# EAGLE schematic SCHEMATIC (EAGLE 9.6.2)

## Sheet 1 of 2
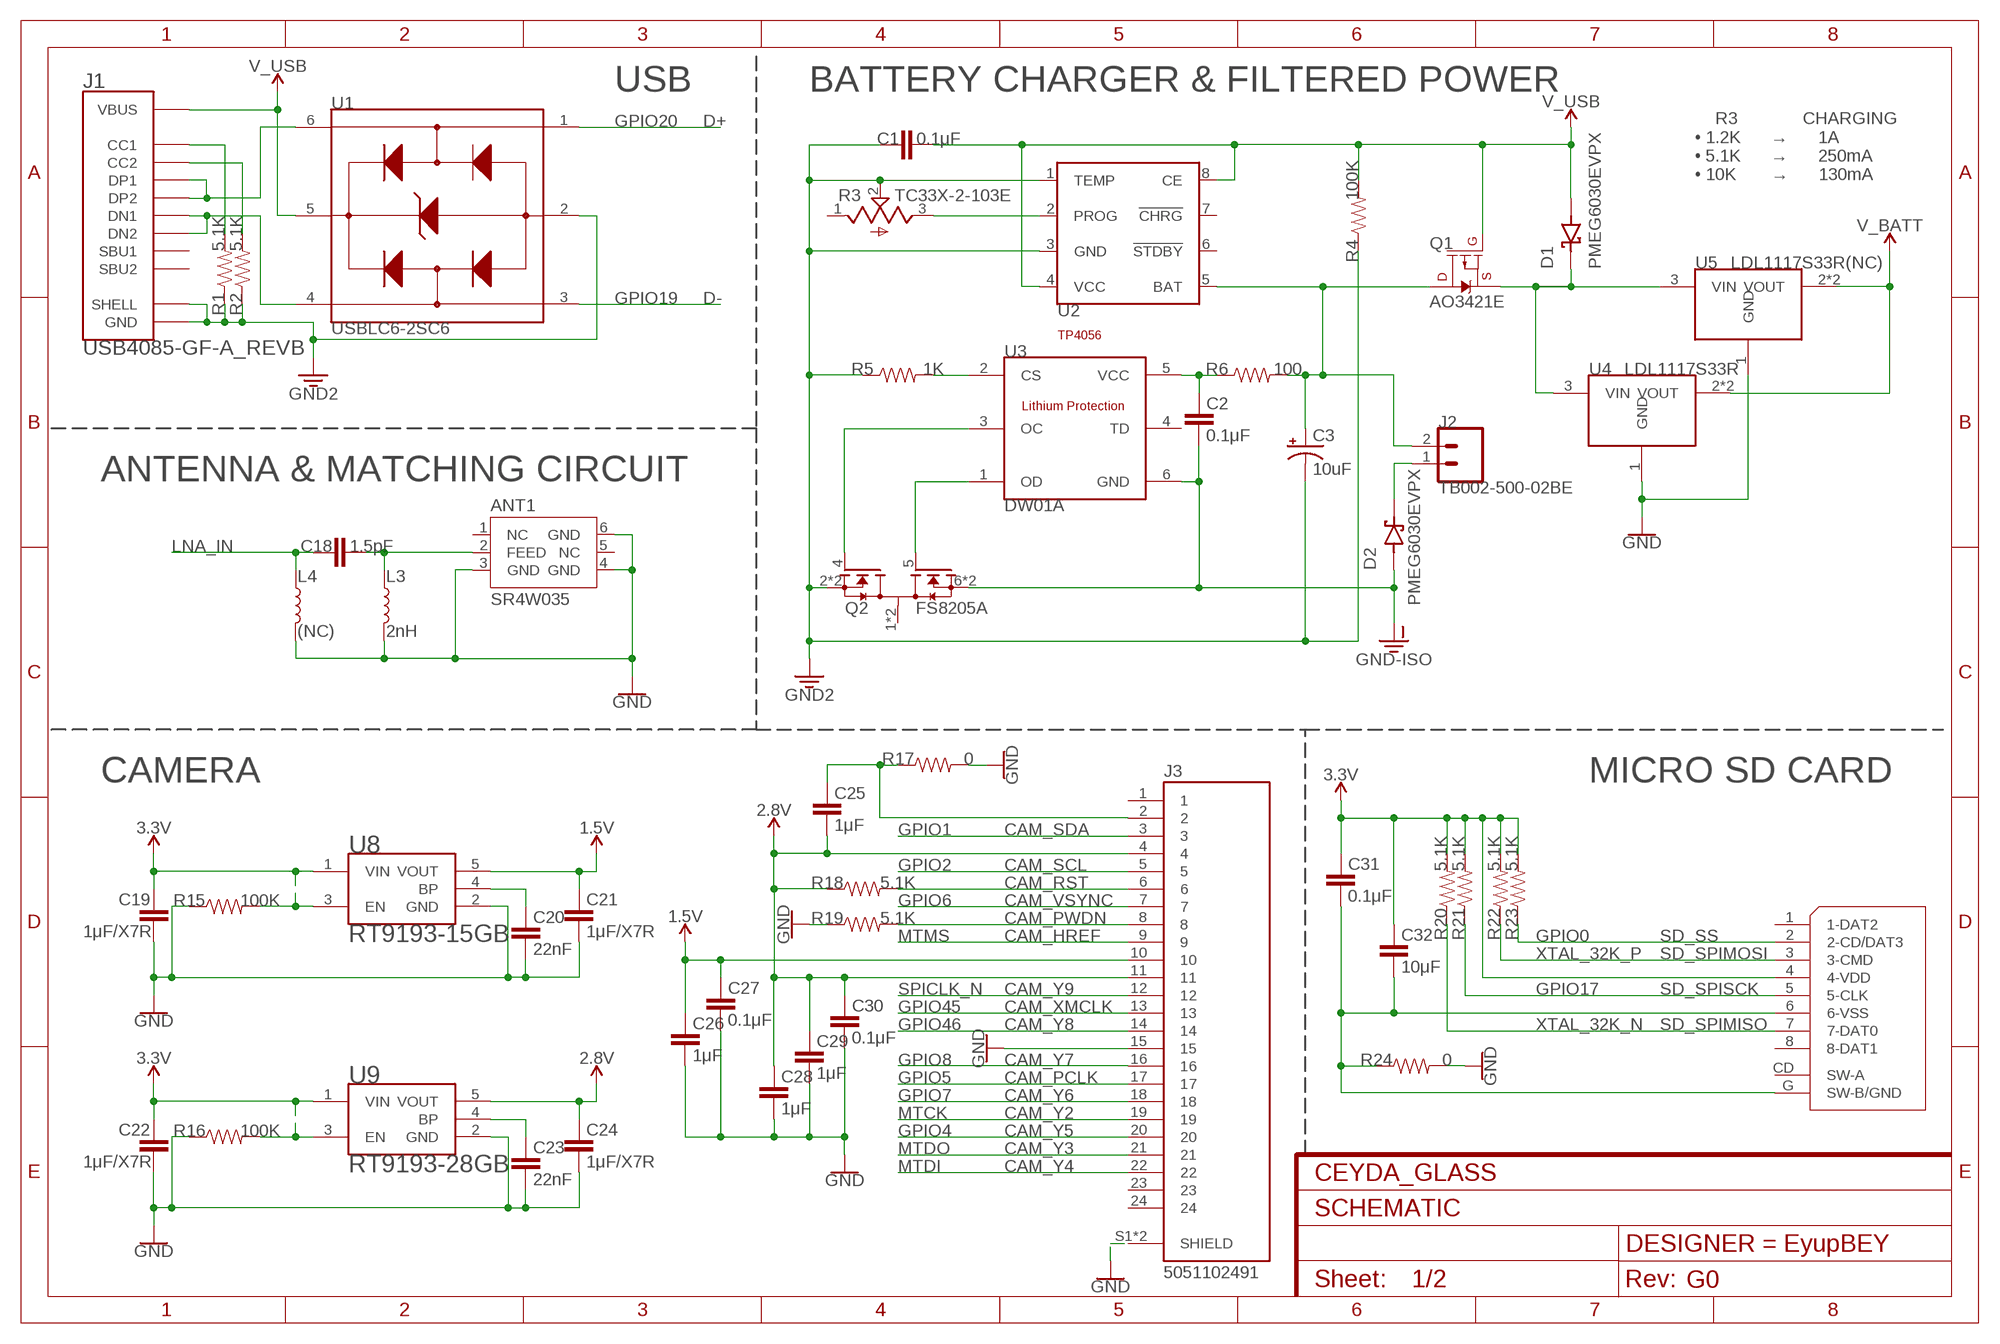
[diagram p0: schematic, sheet 1]
FRAME1 (FRAME-A4L): CNAME: CEYDA_GLASS; CREVISION: G0; DESIGNER: EyupBEY

### Parts
ANT1  SR4W035  [SR4W035]
C1  0.1μF  1.0UF-0805-25V-10%  [0805]
C2  0.1μF  1.0UF-0805-25V-10%  [0805]
C3  10uF  10UF-POLAR-RADIAL-2.5MM-25V-20%  [CPOL-RADIAL-2.5MM-5MM]
C18  1.5pF  15PF-0402-50V-5%  [0402]
C19  1μF/X7R  1.0UF-0805-25V-10%  [0805]
C20  22nF  10NF-0603-50V-10%  [0603]
C21  1μF/X7R  1.0UF-0805-25V-10%  [0805]
C22  1μF/X7R  1.0UF-0805-25V-10%  [0805]
C23  22nF  10NF-0603-50V-10%  [0603]
C24  1μF/X7R  1.0UF-0805-25V-10%  [0805]
C25  1μF  1.0UF-0805-25V-10%  [0805]
C26  1μF  1.0UF-0805-25V-10%  [0805]
C27  0.1μF  1.0UF-0805-25V-10%  [0805]
C28  1μF  1.0UF-0805-25V-10%  [0805]
C29  1μF  1.0UF-0805-25V-10%  [0805]
C30  0.1μF  1.0UF-0805-25V-10%  [0805]
C31  0.1μF  1.0UF-0805-25V-10%  [0805]
C32  10μF  1.0UF-0805-25V-10%  [0805]
D1  PMEG6030EVPX  [DIO_PMEG6030EVPX]
D2  PMEG6030EVPX  [DIO_PMEG6030EVPX]
J1  USB4085-GF-A_REVB  [GCT_USB4085-GF-A_REVB]
J2  TB002-500-02BE  CONN_025MM  [SCREWTERMINAL-5MM-2]
J3  5051102491  [MOLEX_5051102491]
K1  112J-TDAR-R01  [112J-TDAR-R01]
L3  2nH  INDUCTOR-0402-3.9NH  [0402]
L4  (NC)  INDUCTOR-0402-3.9NH  [0402]
Q1  AO3421E  MOSFET_PCH-DMG2307L  [SOT23-3]
Q2  FS8205A  [SOP65P640X120-8N]
R1  5.1K  5.1KOHM5.1KOHM-0603-1/10W-1%  [0603]
R2  5.1K  5.1KOHM5.1KOHM-0603-1/10W-1%  [0603]
R3  TC33X-2-103E  [TRIM_TC33X-2-103E]
R4  100K  0OHM-0603-1/10W  [0603]
R5  1K  1KOHM-0603-1/10W-1%  [0603]
R6  100  100OHM-0603-1/10W-1%  [0603]
R15  100K  0OHM-0603-1/10W  [0603]
R16  100K  0OHM-0603-1/10W  [0603]
R17  0  0OHM-0603-1/10W  [0603]
R18  5.1K  5.1KOHM5.1KOHM-0603-1/10W-1%  [0603]
R19  5.1K  5.1KOHM5.1KOHM-0603-1/10W-1%  [0603]
R20  5.1K  5.1KOHM5.1KOHM-0603-1/10W-1%  [0603]
R21  5.1K  5.1KOHM5.1KOHM-0603-1/10W-1%  [0603]
R22  5.1K  5.1KOHM5.1KOHM-0603-1/10W-1%  [0603]
R23  5.1K  5.1KOHM5.1KOHM-0603-1/10W-1%  [0603]
R24  0  0OHM-0603-1/10W  [0603]
U1  USBLC6-2SC6  [SOT95P280X145-6N]
U2  TP4056  [SOT23-8]
U3  DW01A  [SOT23-6]
U4  LDL1117S33R  [SOT230P700X180-4N]
U5  LDL1117S33R(NC)  LDL1117S33R  [SOT230P700X180-4N]
U8  RT9193-15GB  RT9193-33GB  [SOT94P279X129-5N]
U9  RT9193-28GB  RT9193-33GB  [SOT94P279X129-5N]

### Nets
1.8V: C21.2 C26.2 C27.2 J3.10 U8.5(VOUT) ; supply symbol labelled 1.5V
2.8V: C24.2 C25.1 C28.2 C29.2 C30.2 J3.4 J3.11 R18.1 U9.5(VOUT)
3.3V: C1.1 C3.2(-) C19.2 C22.2 C31.2 C32.2 J1.A1(GND) J1.A12(GND) J1.B1(GND) J1.B12(GND) J1.S1(SHELL) J1.S2(SHELL) J1.S3(SHELL) J1.S4(SHELL) K1.4(4-VDD) Q2.2(S1) Q2.3(S1) R1.1 R2.1 R3.2(W) R4.1 R5.1 R15.2 R16.2 R20.2 R21.2 R22.2 R23.2 U1.2(GND) U2.1(TEMP) U2.3(GND) U8.1(VIN) U8.3(EN) U9.1(VIN) U9.3(EN) ; supply symbol labelled GND2 ; also sheet 2
GND: ANT1.3(GND) ANT1.4(GND) ANT1.6(GND) C19.1 C20.1 C21.1 C22.1 C23.1 C24.1 C26.1 C27.1 C28.1 C29.1 C30.1 J3.15 J3.S1(SHIELD) J3.S2(SHIELD) L3.2 L4.2 R15.1 R16.1 R17.2 R19.1 R24.2 U4.1(GND) U5.1(GND) U8.2(GND) U9.2(GND) ; also sheet 2
GND-ISO: C2.1 D2.2(A) Q2.6(S2) Q2.7(S2) U3.6(GND) ; also sheet 2
GPIO0: K1.2(2-CD/DAT3) R23.1 ; also sheet 2
GPIO1: J3.3 ; also sheet 2
GPIO2: J3.5 ; also sheet 2
GPIO4: J3.20 ; also sheet 2
GPIO5: J3.17 ; also sheet 2
GPIO6: J3.7 ; also sheet 2
GPIO7: J3.18 ; also sheet 2
GPIO8: J3.16 ; also sheet 2
GPIO17: K1.5(5-CLK) R21.1 ; also sheet 2
GPIO19: U1.3(I/O2_IN) ; also sheet 2
GPIO20: U1.1(I/O1_IN) ; also sheet 2
GPIO45: J3.13 ; also sheet 2
GPIO46: J3.14 ; also sheet 2
LNA_IN: C18.1 L4.1 ; also sheet 2
MTCK: J3.19 ; also sheet 2
MTDI: J3.22 ; also sheet 2
MTDO: J3.21 ; also sheet 2
MTMS: J3.9 ; also sheet 2
N$1: J1.A7(DN1) J1.B7(DN2) U1.4(I/O2_OUT)
N$2: Q2.5(G2) U3.1(OD)
N$3: Q2.4(G1) U3.3(OC)
N$4: J1.A6(DP1) J1.B6(DP2) U1.6(I/O1_OUT)
N$5: R5.2 U3.2(CS)
N$6: J1.A5(CC1) R1.2
N$7: J1.B5(CC2) R2.2
N$8: R3.3(CW) U2.2(PROG)
N$10: D2.1(K) J2.1
N$11: C2.2 R6.1 U3.5(VCC)
N$12: ANT1.2(FEED) C18.2 L3.1
N$16: C20.2 U8.4(BP)
N$17: C23.2 U9.4(BP)
N$18: C25.2 J3.2 R17.1
N$19: J3.8 R19.2
N$20: C31.1 C32.1 K1.6(6-VSS) K1.G(SW-B/GND) R24.1
N$23: C3.1(+) J2.2 Q1.3(D) R6.2 U2.5(BAT)
N$27: J3.6 R18.2
N$28: D1.1(K) Q1.2(S) U4.3(VIN) U5.3(VIN)
SPICLK_N: J3.12 ; also sheet 2
V_BATT: U4.2(VOUT) U4.4(VOUT) U5.2(VOUT) U5.4(VOUT) ; also sheet 2
V_USB: C1.2 D1.2(A) J1.A4(VBUS) J1.A9(VBUS) J1.B4(VBUS) J1.B9(VBUS) Q1.1(G) R4.2 U1.5(VBUS) U2.4(VCC) U2.8(CE)
XTAL_32K_N: K1.7(7-DAT0) R20.1 ; also sheet 2
XTAL_32K_P: K1.3(3-CMD) R22.1 ; also sheet 2
Unconnected: ANT1.1(NC) ANT1.5(NC) J1.A8(SBU1) J1.B8(SBU2) J3.1 J3.23 J3.24 K1.1(1-DAT2) K1.8(8-DAT1) K1.CD(SW-A) Q2.1(D12) Q2.8(D12) R3.1(CCW) U2.6(!STDBY) U2.7(!CHRG) U3.4(TD)

### Notes on the sheet
- USB | BATTERY CHARGER & FILTERED POWER
- D+
- R3             CHARGING
  • 1.2K      →      1A
  • 5.1K      →      250mA
  • 10K       →      130mA
- D-
- ANTENNA & MATCHING CIRCUIT
- CAMERA | MICRO SD CARD
- CAM_SDA
- CAM_SCL
- CAM_RST
- CAM_VSYNC
- CAM_PWDN
- CAM_HREF | SD_SS
- SD_SPIMOSI
- CAM_Y9 | SD_SPISCK
- CAM_XMCLK
- CAM_Y8 | SD_SPIMISO
- CAM_Y7
- CAM_PCLK
- CAM_Y6
- CAM_Y2
- CAM_Y5
- CAM_Y3
- CAM_Y4

## Sheet 2 of 2
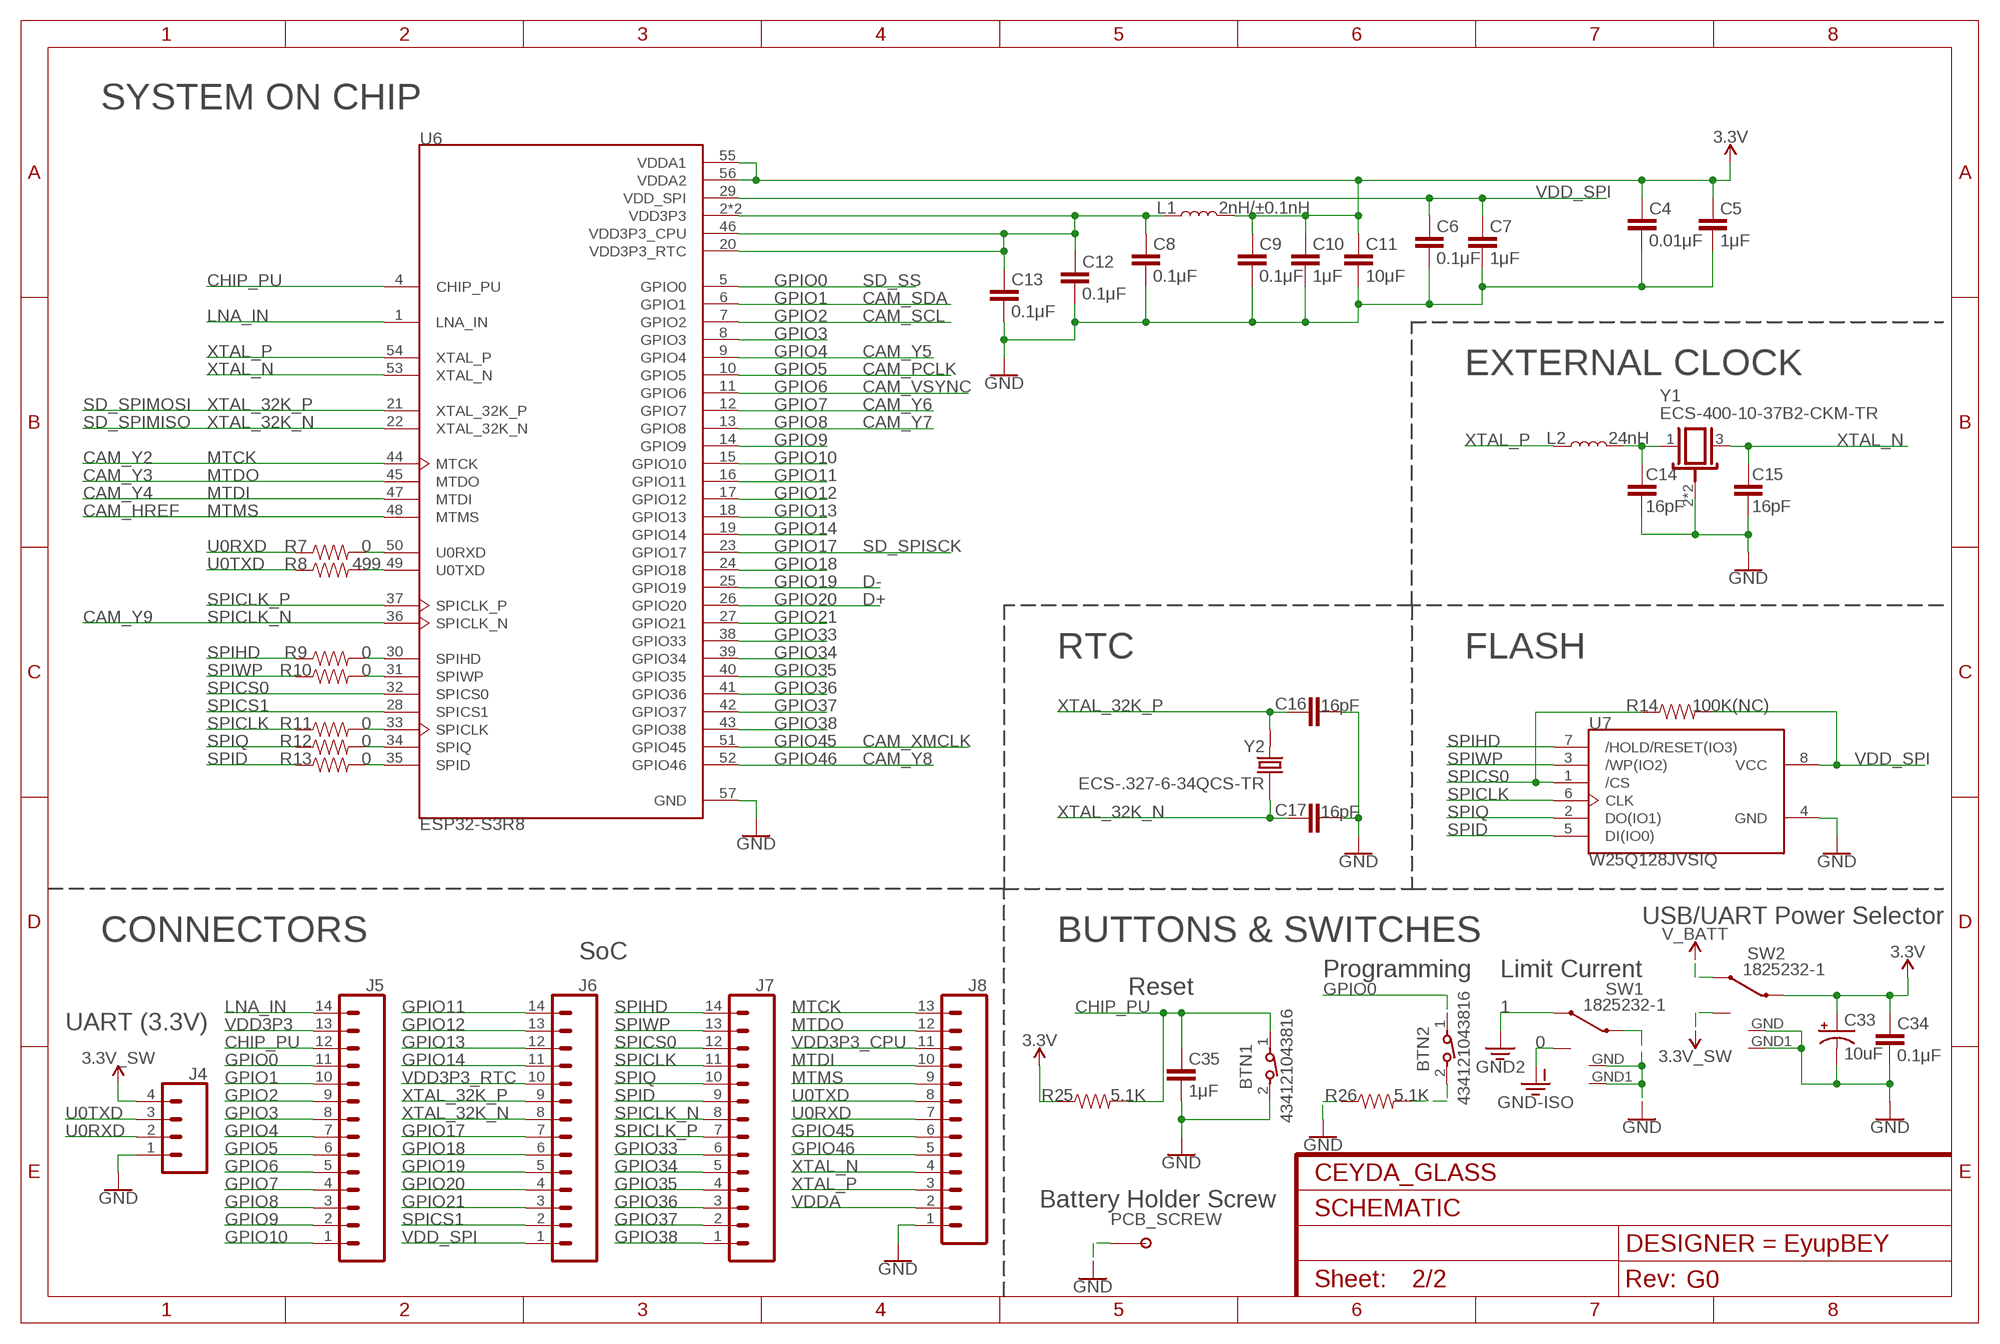
[diagram p1: schematic, sheet 2]
FRAME2 (FRAME-A4L): CNAME: CEYDA_GLASS; CREVISION: G0; DESIGNER: EyupBEY

### Parts
BTN1  434121043816  [434121043816]
BTN2  434121043816  [434121043816]
C4  0.01μF  10NF-0603-50V-10%  [0603]
C5  1μF  1.0UF-0805-25V-10%  [0805]
C6  0.1μF  1.0UF-0805-25V-10%  [0805]
C7  1μF  1.0UF-0805-25V-10%  [0805]
C8  0.1μF  1.0UF-0805-25V-10%  [0805]
C9  0.1μF  1.0UF-0805-25V-10%  [0805]
C10  1μF  1.0UF-0805-25V-10%  [0805]
C11  10μF  1.0UF-0805-25V-10%  [0805]
C12  0.1μF  1.0UF-0805-25V-10%  [0805]
C13  0.1μF  1.0UF-0805-25V-10%  [0805]
C14  16pF  0.1UF-0402-16V-10%  [0402]
C15  16pF  0.1UF-0402-16V-10%  [0402]
C16  16pF  0.1UF-0402-16V-10%  [0402]
C17  16pF  0.1UF-0402-16V-10%  [0402]
C33  10uF  10UF-POLAR-RADIAL-2.5MM-25V-20%  [CPOL-RADIAL-2.5MM-5MM]
C34  0.1μF  1.0UF-0805-25V-10%  [0805]
C35  1μF  1.0UF-0805-25V-10%  [0805]
J4  CONN_04PTH  [1X04]
J5  CONN_14  [1X14]
J6  CONN_14  [1X14]
J7  CONN_14  [1X14]
J8  CONN_13  [1X13]
L1  2nH/±0.1nH  INDUCTOR-0402-3.9NH  [0402]
L2  24nH  INDUCTOR-0603-15NH  [0603]
PCB_SCREW  PCB_SCREW_TERMINAL  [NINIGI_PCB_1M4]
R7  0  0OHM-0603-1/10W  [0603]
R8  499  0OHM-0603-1/10W  [0603]
R9  0  0OHM-0603-1/10W  [0603]
R10  0  0OHM-0603-1/10W  [0603]
R11  0  0OHM-0603-1/10W  [0603]
R12  0  0OHM-0603-1/10W  [0603]
R13  0  0OHM-0603-1/10W  [0603]
R14  100K(NC)  0OHM-0603-1/10W  [0603]
R25  5.1K  5.1KOHM5.1KOHM-0603-1/10W-1%  [0603]
R26  5.1K  5.1KOHM5.1KOHM-0603-1/10W-1%  [0603]
SW1  1825232-1  [1825232-1]
SW2  1825232-1  [1825232-1]
U6  ESP32-S3R8  ESP32-S3  [IC_ESP32-S3]
U7  W25Q128JVSIQ  [SOIC127P790X216-8N]
Y1  ECS-400-10-37B2-CKM-TR  [XTAL_ECS-400-10-37B2-CKM-TR]
Y2  ECS-.327-6-34QCS-TR  [XTAL_ECS-.327-6-34QCS-TR]

### Nets
3.3V: C4.2 C5.2 C9.2 C10.2 C11.2 C33.1(+) C34.2 L1.2 R25.1 SW1.3 SW2.2 U6.55(VDDA1) U6.56(VDDA2) ; supply symbol labelled GND2 ; also sheet 1
3.3V_SW: J4.4 SW2.1
CHIP_PU: BTN1.1 C35.2 J5.12 R25.2 U6.4(CHIP_PU)
GND: BTN1.2 C4.1 C5.1 C6.1 C7.1 C8.1 C9.1 C10.1 C11.1 C12.1 C13.1 C14.1 C15.1 C16.2 C17.2 C33.2(-) C34.1 C35.1 J4.1 J8.1 PCB_SCREW.1 PCB_SCREW.2 PCB_SCREW.3 PCB_SCREW.4 PCB_SCREW.C R26.1 SW1.2 SW1.GND SW1.GND1 SW2.GND SW2.GND1 U6.57(GND) U7.4(GND) Y1.2(GND) Y1.4(GND) ; also sheet 1
GND-ISO: SW1.1 ; also sheet 1
GPIO0: BTN2.1 J5.11 U6.5(GPIO0) ; also sheet 1
GPIO1: J5.10 U6.6(GPIO1) ; also sheet 1
GPIO2: J5.9 U6.7(GPIO2) ; also sheet 1
GPIO3: J5.8 U6.8(GPIO3)
GPIO4: J5.7 U6.9(GPIO4) ; also sheet 1
GPIO5: J5.6 U6.10(GPIO5) ; also sheet 1
GPIO6: J5.5 U6.11(GPIO6) ; also sheet 1
GPIO7: J5.4 U6.12(GPIO7) ; also sheet 1
GPIO8: J5.3 U6.13(GPIO8) ; also sheet 1
GPIO9: J5.2 U6.14(GPIO9)
GPIO10: J5.1 U6.15(GPIO10)
GPIO11: J6.14 U6.16(GPIO11)
GPIO12: J6.13 U6.17(GPIO12)
GPIO13: J6.12 U6.18(GPIO13)
GPIO14: J6.11 U6.19(GPIO14)
GPIO17: J6.7 U6.23(GPIO17) ; also sheet 1
GPIO18: J6.6 U6.24(GPIO18)
GPIO19: J6.5 U6.25(GPIO19) ; also sheet 1
GPIO20: J6.4 U6.26(GPIO20) ; also sheet 1
GPIO21: J6.3 U6.27(GPIO21)
GPIO33: J7.6 U6.38(GPIO33)
GPIO34: J7.5 U6.39(GPIO34)
GPIO35: J7.4 U6.40(GPIO35)
GPIO36: J7.3 U6.41(GPIO36)
GPIO37: J7.2 U6.42(GPIO37)
GPIO38: J7.1 U6.43(GPIO38)
GPIO45: J8.6 U6.51(GPIO45) ; also sheet 1
GPIO46: J8.5 U6.52(GPIO46) ; also sheet 1
LNA_IN: J5.14 U6.1(LNA_IN) ; also sheet 1
MTCK: J8.13 U6.44(MTCK) ; also sheet 1
MTDI: J8.10 U6.47(MTDI) ; also sheet 1
MTDO: J8.12 U6.45(MTDO) ; also sheet 1
MTMS: J8.9 U6.48(MTMS) ; also sheet 1
N$9: C8.2 C12.2 C13.2 L1.1 U6.2(VDD3P3) U6.3(VDD3P3) U6.20(VDD3P3_RTC) U6.46(VDD3P3_CPU)
N$13: C14.2 L2.2 Y1.1
N$21: R7.2 U6.50(U0RXD)
N$22: R8.2 U6.49(U0TXD)
N$25: R9.2 U6.30(SPIHD)
N$26: R10.2 U6.31(SPIWP)
N$29: R11.2 U6.33(SPICLK)
N$30: R12.2 U6.34(SPIQ)
N$31: R13.2 U6.35(SPID)
N$32: BTN2.2 R26.2
SPICLK: J7.11 R11.1 U7.6(CLK)
SPICLK_N: J7.8 U6.36(SPICLK_N) ; also sheet 1
SPICLK_P: J7.7 U6.37(SPICLK_P)
SPICS0: J7.12 R14.1 U6.32(SPICS0) U7.1(/CS)
SPICS1: J6.2 U6.28(SPICS1)
SPID: J7.9 R13.1 U7.5(DI(IO0))
SPIHD: J7.14 R9.1 U7.7(/HOLD/RESET(IO3))
SPIQ: J7.10 R12.1 U7.2(DO(IO1))
SPIWP: J7.13 R10.1 U7.3(/WP(IO2))
U0RXD: J4.2 J8.7 R7.1
U0TXD: J4.3 J8.8 R8.1
V_BATT: SW2.3 ; also sheet 1
VDD3P3: J5.13
VDD3P3_CPU: J8.11
VDD3P3_RTC: J6.10
VDD_SPI: C6.2 C7.2 J6.1 R14.2 U6.29(VDD_SPI) U7.8(VCC)
VDDA: J8.2
XTAL_32K_N: C17.1 J6.8 U6.22(XTAL_32K_N) Y2.1(I/O) ; also sheet 1
XTAL_32K_P: C16.1 J6.9 U6.21(XTAL_32K_P) Y2.2(O/I) ; also sheet 1
XTAL_N: C15.2 J8.4 U6.53(XTAL_N) Y1.3
XTAL_P: J8.3 L2.1 U6.54(XTAL_P)

### Notes on the sheet
- SYSTEM ON CHIP
- SD_SS
- CAM_SDA
- CAM_SCL
- CAM_Y5
- CAM_PCLK | EXTERNAL CLOCK
- CAM_VSYNC
- SD_SPIMOSI | CAM_Y6
- SD_SPIMISO | CAM_Y7
- CAM_Y2
- CAM_Y3
- CAM_Y4
- CAM_HREF
- SD_SPISCK
- D-
- D+
- CAM_Y9
- RTC | FLASH
- CAM_XMCLK
- CAM_Y8
- USB/UART Power Selector
- CONNECTORS | BUTTONS & SWITCHES
- SoC
- Programming | Limit Current
- Reset
- 1
- UART (3.3V)
- 0
- Battery Holder Screw

## Library data of the parts
ANT1 = SR4W035:SR4W035
BTN1 BTN2 = 434121043816:434121043816: WS-TASV SMT Tact Switch 6.0x3.5 mm MATERIAL PROPERTIES Cover Material Stainless Steel PROPERTIES Actuator Material LCP Actuator Flammability Rating UL94 V-0 Actuator Color Black; Salmon; White Frame Material LCP Frame Flammability Rating UL94 V-0 Frame Color Black; White Contact Material Stainless Steel Contact Plating Silver Terminal Material Copper Alloy Terminal Plating Silver VR 12 V (DC) Contact Resistance Initial 100 mΩ Contact Resistance After Life Test 1 Ω RISO 100 MΩ Withstanding Voltage 250 V (AC) Washable No Qty. 1500; 1800 Mechanical Properties Stroke 0.25 mm GENERAL INFORMATION Operating Temperature -40 up to +85 °C PACKAGING PROPERTIES Packaging Tape and Reel <https://www.we-online.com/catalog/media/o37582v209%20WS-TASV_4341X1XXX8X6_Family.jpg> Details see: https://www.we-online.com/catalog/en/TASV_6_0X3_5_SMD/ Created by Yingchun,Shan 2020-02-20 2020(C) Wurth Elektronik Check availability <https://pricing.snapeda.com/parts/434121043816/Wurth%20Elektronik/view-part?ref=eda>; AVAILABILITY: In Stock; CHECK_PRICES: https://www.snapeda.com/parts/434121043816/Wurth+Elektronik/view-part/?ref=eda; DESCRIPTION: Tactile Switch SPST-NO Top Actuated Surface Mount; MF: Wurth Elektronik; MP: 434121043816; PACKAGE: None; PRICE: None; PURCHASE-URL: https://www.snapeda.com/api/url_track_click_mouser/?unipart_id=4966086&manufacturer=Wurth Elektronik&part_name=434121043816&search_term=None; SNAPEDA_LINK: https://www.snapeda.com/parts/434121043816/Wurth+Elektronik/view-part/?ref=snap
C1 C2 C5-C13 C19 C21 C22 C24-C32 C34 C35 = SparkFun-Capacitors:1.0UF: 1µF ceramic capacitors A capacitor is a passive two-terminal electrical component used to store electrical energy temporarily in an electric field.; PROD_ID: CAP-08064; VALUE: 1.0uF
C3 C33 = SparkFun-Capacitors:10UF-POLAR: 10.0µF polarized capacitors A capacitor is a passive two-terminal electrical component used to store electrical energy temporarily in an electric field.; PROD_ID: CAP-08440
C4 C20 C23 = SparkFun-Capacitors:10NF: 0.01uF/10nF/10,000pF ceramic capacitors A capacitor is a passive two-terminal electrical component used to store electrical energy temporarily in an electric field. CAP-09321; PROD_ID: CAP-00867; VALUE: 10nF
C14-C17 = SparkFun-Capacitors:0.1UF: 0.1µF ceramic capacitors A capacitor is a passive two-terminal electrical component used to store electrical energy temporarily in an electric field.; PROD_ID: CAP-12416; VALUE: 0.1uF
C18 = SparkFun-Capacitors:15PF: 15pF ceramic capacitors A capacitor is a passive two-terminal electrical component used to store electrical energy temporarily in an electric field.; PROD_ID: CAP-13063; VALUE: 15pF
D1 D2 = PMEG6030EVPX:PMEG6030EVPX: PMEG6030 Series 60 V 3 A Surface Mount Schottky Barrier Rectifier - SOD-128 Check availability <https://pricing.snapeda.com/parts/PMEG6030EVPX/Nexperia%20USA%20Inc./view-part?ref=eda>; AVAILABILITY: In Stock; CHECK_PRICES: https://www.snapeda.com/parts/PMEG6030EVPX/Nexperia/view-part/?ref=eda; DESCRIPTION: Diode Schottky 60 V 3A Surface Mount SOD-128/CFP5; MF: Nexperia USA Inc.; MP: PMEG6030EVPX; PACKAGE: CFP5-2 Nexperia USA Inc.; PRICE: None; PURCHASE-URL: https://www.snapeda.com/api/url_track_click_mouser/?unipart_id=7740717&manufacturer=Nexperia USA Inc.&part_name=PMEG6030EVPX&search_term=None; SNAPEDA_LINK: https://www.snapeda.com/parts/PMEG6030EVPX/Nexperia/view-part/?ref=snap
J1 = USB4085-GF-A_REVB:USB4085-GF-A_REVB: Check availability <https://pricing.snapeda.com/parts/USB4085-GF-A/Global%20Connector%20Technology/view-part?ref=eda>; AVAILABILITY: In Stock; CHECK_PRICES: https://www.snapeda.com/parts/USB4085-GF-A/Global+Connector+Technology/view-part/?ref=eda; DESCRIPTION: USB-C (USB TYPE-C) USB 2.0 Receptacle Connector 24 (16+8 Dummy) Position Through Hole, Right Angle, low cost, 3.46mm profile, 16 pin, horizontal, Top mount; MF: Global Connector Technology; MP: USB4085-GF-A; PACKAGE: None; PRICE: None; PURCHASE-URL: https://www.snapeda.com/api/url_track_click_mouser/?unipart_id=2780390&manufacturer=Global Connector Technology&part_name=USB4085-GF-A&search_term=None; SNAPEDA_LINK: https://www.snapeda.com/parts/USB4085-GF-A/Global+Connector+Technology/view-part/?ref=snap
J2 = SparkFun-Connectors:CONN_02: Multi connection point. Often used as Generic Header-pin footprint for 0.1 inch spaced/style header connections On any of the 0.1 inch spaced packages, you can populate with these: Break Away Headers - Straight <https://www.sparkfun.com/products/116> (PRT-00116) Break Away Male Headers - Right Angle <https://www.sparkfun.com/products/553> (PRT-00553) Female Headers <https://www.sparkfun.com/products/115> (PRT-00115) Break Away Headers - Machine Pin <https://www.sparkfun.com/products/117> (PRT-00117) Break Away Female Headers - Swiss Machine Pin <https://www.sparkfun.com/products/743> (PRT-00743) For SCREWTERMINALS and SPRING TERMINALS visit here: Screw Terimnals on SparkFun.com <https://www.sparkfun.com/search/results?term=Screw+Terminals> (5mm/3.5mm/2.54mm spacing) This device is also useful as a general connection point to wire up your design to another part of your project. Our various solder wires solder well into these plated through hole pads. Hook-Up Wire - Assortment (Stranded, 22 AWG) <https://www.sparkfun.com/products/11375> (PRT-11375) Hook-Up Wire - Assortment (Solid Core, 22 AWG) <https://www.sparkfun.com/products/11367> (PRT-11367) View the entire wire category on our website here <https://www.sparkfun.com/categories/141> Special notes: Molex polarized connector foot print use with: PRT-08233 with associated crimp pins and housings. 2.54_SCREWTERM for use with PRT-10571. 3.5mm Screw Terminal footprints for PRT-08084 5mm Screw Terminal footprints for use with PRT-08432; SF_SKU: PRT-08432
J3 = 5051102491:5051102491: Check availability <https://pricing.snapeda.com/parts/505110-2491/Molex/view-part?ref=eda>; AVAILABILITY: In Stock; CHECK_PRICES: https://www.snapeda.com/parts/505110-2491/Molex/view-part/?ref=eda; DESCRIPTION: Conn; Rect; Rt. Angle; FFC/FPC; 0.50MM Pitch; 24 Circuit; Bottom Contact; ZIF | Molex Incorporated 505110-2491; MF: Molex; MP: 505110-2491; PACKAGE: None; PRICE: None; PURCHASE-URL: https://www.snapeda.com/api/url_track_click_mouser/?unipart_id=699820&manufacturer=Molex&part_name=505110-2491&search_term=None; SNAPEDA_LINK: https://www.snapeda.com/parts/505110-2491/Molex/view-part/?ref=snap
J4 = SparkFun-Connectors:CONN_04: Multi connection point. Often used as Generic Header-pin footprint for 0.1 inch spaced/style header connections On any of the 0.1 inch spaced packages, you can populate with these: Break Away Headers - Straight <https://www.sparkfun.com/products/116> (PRT-00116) Break Away Male Headers - Right Angle <https://www.sparkfun.com/products/553> (PRT-00553) Female Headers <https://www.sparkfun.com/products/115> (PRT-00115) Break Away Headers - Machine Pin <https://www.sparkfun.com/products/117> (PRT-00117) Break Away Female Headers - Swiss Machine Pin <https://www.sparkfun.com/products/743> (PRT-00743) For SCREWTERMINALS and SPRING TERMINALS visit here: Screw Terimnals on SparkFun.com <https://www.sparkfun.com/search/results?term=Screw+Terminals> (5mm/3.5mm/2.54mm spacing) This device is also useful as a general connection point to wire up your design to another part of your project. Our various solder wires solder well into these plated through hole pads. Hook-Up Wire - Assortment (Stranded, 22 AWG) <https://www.sparkfun.com/products/11375> (PRT-11375) Hook-Up Wire - Assortment (Solid Core, 22 AWG) <https://www.sparkfun.com/products/11367> (PRT-11367) View the entire wire category on our website here <https://www.sparkfun.com/categories/141> Special notes: Molex polarized connector foot print use with SKU : PRT-08231 with associated crimp pins and housings. 1MM SMD Version SKU: PRT-10208; PROD_ID: CONN-09696
J5-J7 = SparkFun-Connectors:CONN_14: Multi connection point. Often used as Generic Header-pin footprint for 0.1 inch spaced/style header connections On any of the 0.1 inch spaced packages, you can populate with these: Break Away Headers - Straight <https://www.sparkfun.com/products/116> (PRT-00116) Break Away Male Headers - Right Angle <https://www.sparkfun.com/products/553> (PRT-00553) Female Headers <https://www.sparkfun.com/products/115> (PRT-00115) Break Away Headers - Machine Pin <https://www.sparkfun.com/products/117> (PRT-00117) Break Away Female Headers - Swiss Machine Pin <https://www.sparkfun.com/products/743> (PRT-00743) For SCREWTERMINALS and SPRING TERMINALS visit here: Screw Terimnals on SparkFun.com <https://www.sparkfun.com/search/results?term=Screw+Terminals> (5mm/3.5mm/2.54mm spacing) This device is also useful as a general connection point to wire up your design to another part of your project. Our various solder wires solder well into these plated through hole pads. Hook-Up Wire - Assortment (Stranded, 22 AWG) <https://www.sparkfun.com/products/11375> (PRT-11375) Hook-Up Wire - Assortment (Solid Core, 22 AWG) <https://www.sparkfun.com/products/11367> (PRT-11367) View the entire wire category on our website here <https://www.sparkfun.com/categories/141> Special notes: Molex polarized connector foot print use with SKU : PRT-08231 with associated crimp pins and housings. 1MM SMD Version SKU: PRT-10208 NOTES ON THE VARIANTS LOCK and LOCK_LONGPADS... This footprint was designed to help hold the alignment of a through-hole component (i.e. 6-pin header) while soldering it into place. You may notice that each hole has been shifted either up or down by 0.005 of an inch from it's more standard position (which is a perfectly straight line). This slight alteration caused the pins (the squares in the middle) to touch the edges of the holes. Because they are alternating, it causes a "brace" to hold the component in place. 0.005 has proven to be the perfect amount of "off-center" position when using our standard breakaway headers. Although looks a little odd when you look at the bare footprint, once you have a header in there, the alteration is very hard to notice. Also,if you push a header all the way into place, it is covered up entirely on the bottom side.
J8 = SparkFun-Connectors:CONN_13: Multi connection point. Often used as Generic Header-pin footprint for 0.1 inch spaced/style header connections On any of the 0.1 inch spaced packages, you can populate with these: Break Away Headers - Straight <https://www.sparkfun.com/products/116> (PRT-00116) Break Away Male Headers - Right Angle <https://www.sparkfun.com/products/553> (PRT-00553) Female Headers <https://www.sparkfun.com/products/115> (PRT-00115) Break Away Headers - Machine Pin <https://www.sparkfun.com/products/117> (PRT-00117) Break Away Female Headers - Swiss Machine Pin <https://www.sparkfun.com/products/743> (PRT-00743) For SCREWTERMINALS and SPRING TERMINALS visit here: Screw Terimnals on SparkFun.com <https://www.sparkfun.com/search/results?term=Screw+Terminals> (5mm/3.5mm/2.54mm spacing) This device is also useful as a general connection point to wire up your design to another part of your project. Our various solder wires solder well into these plated through hole pads. Hook-Up Wire - Assortment (Stranded, 22 AWG) <https://www.sparkfun.com/products/11375> (PRT-11375) Hook-Up Wire - Assortment (Solid Core, 22 AWG) <https://www.sparkfun.com/products/11367> (PRT-11367) View the entire wire category on our website here <https://www.sparkfun.com/categories/141> Special notes: Molex polarized connector foot print use with SKU : PRT-08231 with associated crimp pins and housings. 1MM SMD Version SKU: PRT-10208 NOTES ON THE VARIANTS LOCK and LOCK_LONGPADS... This footprint was designed to help hold the alignment of a through-hole component (i.e. 6-pin header) while soldering it into place. You may notice that each hole has been shifted either up or down by 0.005 of an inch from it's more standard position (which is a perfectly straight line). This slight alteration caused the pins (the squares in the middle) to touch the edges of the holes. Because they are alternating, it causes a "brace" to hold the component in place. 0.005 has proven to be the perfect amount of "off-center" position when using our standard breakaway headers. Although looks a little odd when you look at the bare footprint, once you have a header in there, the alteration is very hard to notice. Also,if you push a header all the way into place, it is covered up entirely on the bottom side.
K1 = 112J-TDAR-R01:112J-TDAR-R01: Check availability <https://pricing.snapeda.com/parts/112J-TDAR-R01/Attend/view-part?ref=eda>; AVAILABILITY: In Stock; CHECK_PRICES: https://www.snapeda.com/parts/112J-TDAR-R01/Attend/view-part/?ref=eda; DESCRIPTION: 9 (8 + 1) Position Card Connector Secure Digital - microSD™ Surface Mount, Right Angle Gold; MF: Attend; MP: 112J-TDAR-R01; PACKAGE: None; PRICE: None; SNAPEDA_LINK: https://www.snapeda.com/parts/112J-TDAR-R01/Attend/view-part/?ref=snap
L1 L3 L4 = SparkFun-Coils:INDUCTOR: Inductors Resist changes in electrical current. Basically a coil of wire. SparkFun Products: SparkFun Load Cell Amplifier - HX711 <https://www.sparkfun.com/products/13879> IOIO-OTG - V2.2 <https://www.sparkfun.com/products/13613>; PROD_ID: NDUC-13457; VALUE: 3.9NH
L2 = SparkFun-Coils:INDUCTOR: Inductors Resist changes in electrical current. Basically a coil of wire. SparkFun Products: SparkFun Load Cell Amplifier - HX711 <https://www.sparkfun.com/products/13879> IOIO-OTG - V2.2 <https://www.sparkfun.com/products/13613>; PROD_ID: NDUC-11660; VALUE: 15nH
PCB_SCREW = screw-terminals:PCB_SCREW_TERMINAL
Q1 = SparkFun-DiscreteSemi:MOSFET_PCH: P-channel MOSFETs Voltage controlled devices that allow control of high current outputs. SparkFun Products: SparkFun ESP32 Thing <https://www.sparkfun.com/products/13907> SparkFun ESP8266 Thing <https://www.sparkfun.com/products/13231> SparkFun Pi Servo HAT V2 <https://www.sparkfun.com/products/15316> DMG2305UX-7 (20V/4.2A/SOT23-3); PROD_ID: TRANS-11308; VALUE: 3.1A/30V/105mΩ
Q2 = FS8205A:FS8205A: N/A Check availability <https://pricing.snapeda.com/parts/FS8205A/Fortune%20Semiconductor/view-part?ref=eda>; AVAILABILITY: Not in stock; CHECK_PRICES: https://www.snapeda.com/parts/FS8205A/Fortune+Semiconductor/view-part/?ref=eda; MF: Fortune Semiconductor; MP: FS8205A; PACKAGE: Package; PRICE: None; SNAPEDA_LINK: https://www.snapeda.com/parts/FS8205A/Fortune+Semiconductor/view-part/?ref=snap
R1 R2 R18-R23 R25 R26 = SparkFun-Resistors:5.1KOHM; PROD_ID: RES-12083; VALUE: 5.1k
R3 = TC33X-2-103E:TC33X-2-103E: Res Trimmer 100K Ohm 25% 1/10W 1(Elec)/1(Mech)Turn (3 X 3.8mm) Foot Print SMD Embossed T/R Check availability <https://pricing.snapeda.com/parts/TC33X-2-103E/Bourns/view-part?ref=eda>; AVAILABILITY: In Stock; CHECK_PRICES: https://www.snapeda.com/parts/TC33X-2-103E/Bourns/view-part/?ref=eda; DESCRIPTION: Trimmer, Rest 10 Kilohms, SMD, Pwr-Rtg 0.1W, Dim 0.15inLx0.118inWx0.047inH | Bourns TC33X-2-103E; MF: Bourns; MP: TC33X-2-103E; PACKAGE: SOD-23 Bourns; PRICE: None; PURCHASE-URL: https://www.snapeda.com/api/url_track_click_mouser/?unipart_id=47092&manufacturer=Bourns&part_name=TC33X-2-103E&search_term=None; SNAPEDA_LINK: https://www.snapeda.com/parts/TC33X-2-103E/Bourns/view-part/?ref=snap
R4 R8 R14-R16 = SparkFun-Resistors:0OHM: 0Ω resistor A resistor is a passive two-terminal electrical component that implements electrical resistance as a circuit element. Resistors act to reduce current flow, and, at the same time, act to lower voltage levels within circuits. - Wikipedia; PROD_ID: RES-08609; VALUE: 0
R5 = SparkFun-Resistors:1KOHM: 1kΩ resistor A resistor is a passive two-terminal electrical component that implements electrical resistance as a circuit element. Resistors act to reduce current flow, and, at the same time, act to lower voltage levels within circuits. - Wikipedia; PROD_ID: RES-07856; VALUE: 1k
R6 = SparkFun-Resistors:100OHM: 100Ω resistor A resistor is a passive two-terminal electrical component that implements electrical resistance as a circuit element. Resistors act to reduce current flow, and, at the same time, act to lower voltage levels within circuits. - Wikipedia; PROD_ID: RES-07863
R7 R9-R13 R17 R24 = SparkFun-Resistors:0OHM: 0Ω resistor A resistor is a passive two-terminal electrical component that implements electrical resistance as a circuit element. Resistors act to reduce current flow, and, at the same time, act to lower voltage levels within circuits. - Wikipedia; PROD_ID: RES-08609
SW1 SW2 = 1825232-1:1825232-1: Check availability <https://pricing.snapeda.com/parts/1825232-1/TE%20Connectivity/view-part?ref=eda>; AVAILABILITY: In Stock; CHECK_PRICES: https://www.snapeda.com/parts/1825232-1/TE+Connectivity+ALCOSWITCH+Switches/view-part/?ref=eda; COMMENT: 1825232-1; DESCRIPTION: Switch Slide ON None ON SPDT Side Slide 0.2A 30VDC 10000Cycle PC Pins Bracket Mount/Through Hole; MF: TE Connectivity; MP: 1825232-1; PACKAGE: None; PRICE: None; PURCHASE-URL: https://www.snapeda.com/api/url_track_click_mouser/?unipart_id=379421&manufacturer=TE Connectivity&part_name=1825232-1&search_term=None; SNAPEDA_LINK: https://www.snapeda.com/parts/1825232-1/TE+Connectivity+ALCOSWITCH+Switches/view-part/?ref=snap
U1 = USBLC6-2SC6:USBLC6-2SC6: Check availability <https://pricing.snapeda.com/parts/USBLC6-2SC6/STMicroelectronics/view-part?ref=eda> Check availability <https://pricing.snapeda.com/parts/USBLC6-2SC6/STMicroelectronics/view-part?ref=eda> Check availability <https://pricing.snapeda.com/parts/USBLC6-2SC6/STMicroelectronics/view-part?ref=eda>; AVAILABILITY: In Stock; CHECK_PRICES: https://www.snapeda.com/parts/USBLC6-2SC6/STMicroelectronics/view-part/?ref=eda; DESCRIPTION: 17V Clamp 5A (8/20µs) Ipp Tvs Diode Surface Mount SOT-23-6; MF: STMicroelectronics; MP: USBLC6-2SC6; PACKAGE: SOT-23-6 STMicroelectronics; PRICE: None; SNAPEDA_LINK: https://www.snapeda.com/parts/USBLC6-2SC6/STMicroelectronics/view-part/?ref=snap
U2 = TP4056:TP4056: TP4056 Data sheet <http://goo.gl/J7k8TF> Dave.Calaway Eagle Library <https://goo.gl/Muy1Tr>
U3 = DW01A:DW01A: The DW01A battery protection IC is designed to protect lithium-ion/polymer battery from damage or degrading the lifetime due to overcharge, overdischarge, and/or overcurrent for one-cell lithium-ion/polymer battery powered systems, such as cellular phones. Check availability <https://pricing.snapeda.com/parts/DW01A/Fortune%20Semiconductor/view-part?ref=eda>; AVAILABILITY: Not in stock; CHECK_PRICES: https://www.snapeda.com/parts/DW01A/Fortune+Semiconductor/view-part/?ref=eda; DESCRIPTION: One Cell Lithium-ion/Polymer Battery Protection IC; MF: Fortune Semiconductor; MP: DW01A; PACKAGE: SOT-23-6 Fortune Semiconductor; PRICE: None; SNAPEDA_LINK: https://www.snapeda.com/parts/DW01A/Fortune+Semiconductor/view-part/?ref=snap
U4 U5 = LDL1117S33R:LDL1117S33R: Check availability <https://pricing.snapeda.com/parts/LDL1117S33R/STMicroelectronics/view-part?ref=eda>; AVAILABILITY: In Stock; CHECK_PRICES: https://www.snapeda.com/parts/LDL1117S33R/STMicroelectronics/view-part/?ref=eda; DESCRIPTION: Linear Voltage Regulator IC Positive Fixed 1 Output 1.2A SOT-223; MF: STMicroelectronics; MP: LDL1117S33R; PACKAGE: SOT-223 STMicroelectronics; PRICE: None; SNAPEDA_LINK: https://www.snapeda.com/parts/LDL1117S33R/STMicroelectronics/view-part/?ref=snap
U6 = ESP32-S3:ESP32-S3: Check availability <https://pricing.snapeda.com/parts/ESP32-S3/Espressif%20Systems/view-part?ref=eda>; AVAILABILITY: In Stock; CHECK_PRICES: https://www.snapeda.com/parts/ESP32-S3/Espressif+Systems/view-part/?ref=eda; DESCRIPTION: IC RF TxRx + MCU Bluetooth, WiFi 802.11b/g/n, Bluetooth v5.0 2.412GHz ~ 2.484GHz 56-VFQFN Exposed Pad; MF: Espressif Systems; MP: ESP32-S3; PACKAGE: None; PRICE: None; SNAPEDA_LINK: https://www.snapeda.com/parts/ESP32-S3/Espressif+Systems/view-part/?ref=snap
U7 = W25Q128JVSIQ:W25Q128JVSIQ: Check availability <https://pricing.snapeda.com/parts/W25Q128JVSIQ/Winbond%20Electronics/view-part?ref=eda>; AVAILABILITY: In Stock; CHECK_PRICES: https://www.snapeda.com/parts/W25Q128JVSIQ/Winbond+Electronics/view-part/?ref=eda; DESCRIPTION: FLASH - NOR Memory IC 128Mb (16M x 8) SPI - Quad I/O, QPI, DTR 133 MHz 8-SOIC; MF: Winbond Electronics; MP: W25Q128JVSIQ; PACKAGE: SOIC-8 Winbond Electronics; PRICE: None; PURCHASE-URL: https://www.snapeda.com/api/url_track_click_mouser/?unipart_id=1054022&manufacturer=Winbond Electronics&part_name=W25Q128JVSIQ&search_term=None; SNAPEDA_LINK: https://www.snapeda.com/parts/W25Q128JVSIQ/Winbond+Electronics/view-part/?ref=snap
U8 U9 = RT9193:RT9193-33GB: RT9193 Series 300 mA 3.3 V Ultra-Low Noise Ultra-Fast CMOS LDO Regulator-SC-70-5 Check availability <https://pricing.snapeda.com/parts/RT9193-33GB/Richtek%20USA/view-part?ref=eda>; AVAILABILITY: In Stock; CHECK_PRICES: https://www.snapeda.com/parts/RT9193-33GB/Richtek+USA+Inc./view-part/?ref=eda; DESCRIPTION: Linear Voltage Regulator IC Positive Fixed 1 Output 300mA TSOT-23-5; MF: Richtek USA; MP: RT9193-33GB; PACKAGE: SOT-23-5 Richtek; PRICE: None; PURCHASE-URL: https://www.snapeda.com/api/url_track_click_mouser/?unipart_id=55570&manufacturer=Richtek USA&part_name=RT9193-33GB&search_term=None; SNAPEDA_LINK: https://www.snapeda.com/parts/RT9193-33GB/Richtek+USA+Inc./view-part/?ref=snap
Y1 = ECS-400-10-37B2-CKM-TR:ECS-400-10-37B2-CKM-TR: Check availability <https://pricing.snapeda.com/parts/ECS-400-10-37B2-CKM-TR/ECS%20Inc./view-part?ref=eda>; AVAILABILITY: In Stock; CHECK_PRICES: https://www.snapeda.com/parts/ECS-400-10-37B2-CKM-TR/ECS+Inc./view-part/?ref=eda; DESCRIPTION: Crystal 40MHz ±10ppm (Tol) ±10ppm (Stability) 10pF FUND 40Ohm 4-Pin Mini-CSMD T/R; MF: ECS Inc.; MP: ECS-400-10-37B2-CKM-TR; PACKAGE: SMD-4 ECS Inc.; PRICE: None; PURCHASE-URL: https://www.snapeda.com/api/url_track_click_mouser/?unipart_id=11456102&manufacturer=ECS Inc.&part_name=ECS-400-10-37B2-CKM-TR&search_term=None; SNAPEDA_LINK: https://www.snapeda.com/parts/ECS-400-10-37B2-CKM-TR/ECS+Inc./view-part/?ref=snap
Y2 = ECS-.327-6-34QCS-TR:ECS-.327-6-34QCS-TR: The ECX-34Q is a very compact SMD Tuning Fork Crystal with a 3.2 x 1.5 mm footprint Check availability <https://pricing.snapeda.com/parts/ECS-.327-6-34QCS-TR/ECS%20Inc./view-part?ref=eda>; AVAILABILITY: In Stock; CHECK_PRICES: https://www.snapeda.com/parts/ECS-.327-6-34QCS-TR/ECS+Inc./view-part/?ref=eda; DESCRIPTION: 32.768 kHz ±10ppm Crystal 6pF 70 kOhms 2-SMD, No Lead; MF: ECS Inc.; MP: ECS-.327-6-34QCS-TR; PACKAGE: SMD-2 ECS International; PRICE: None; PURCHASE-URL: https://www.snapeda.com/api/url_track_click_mouser/?unipart_id=2456560&manufacturer=ECS Inc.&part_name=ECS-.327-6-34QCS-TR&search_term=None; SNAPEDA_LINK: https://www.snapeda.com/parts/ECS-.327-6-34QCS-TR/ECS+Inc./view-part/?ref=snap